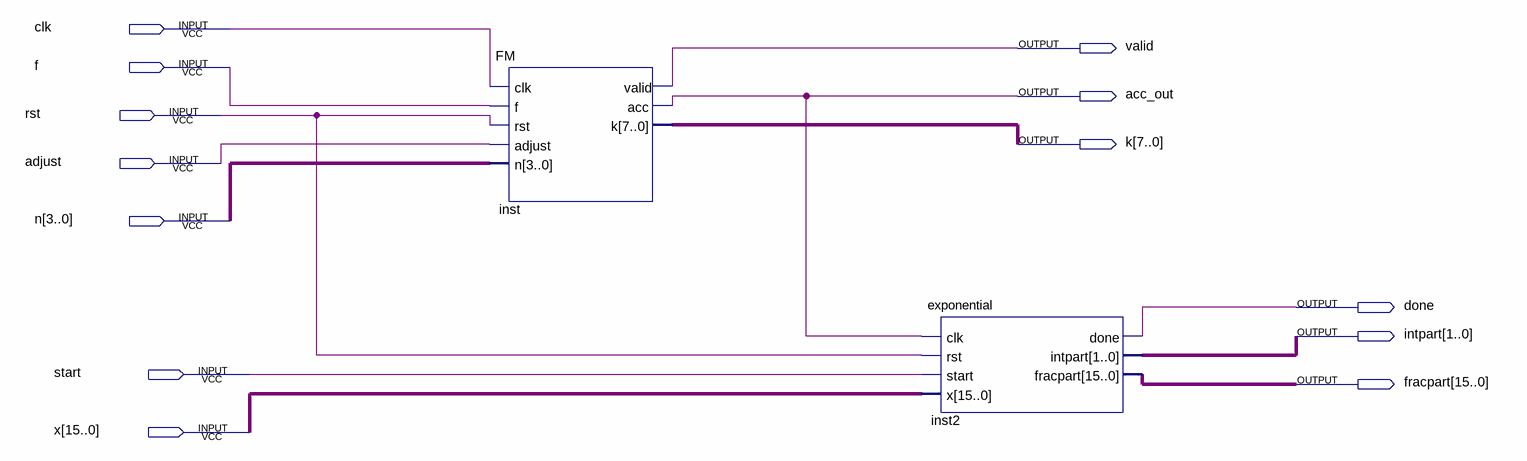
[diagram p0: schematic sheet]
// Quartus schematic IntegratedCircuit.bdf as structural Verilog: 2 symbols, 13 pins
module IntegratedCircuit (
  input  clk,
  input  f,
  input  rst,
  input  adjust,
  input  [3:0] n,
  input  start,
  input  [15:0] x,
  output valid,
  output acc_out,
  output [7:0] k,
  output done,
  output [1:0] intpart,
  output [15:0] fracpart
);

  FM inst (.clk(clk), .f(f), .rst(rst), .adjust(adjust), .n(n), .valid(valid), .acc(acc_out), .k(k));
  exponential inst2 (
    .clk(acc_out), .rst(rst), .start(start), .x(x), .done(done), .intpart(intpart), .fracpart(fracpart));
endmodule
